# EAGLE design pwm-generator (EAGLE 6.5.0)
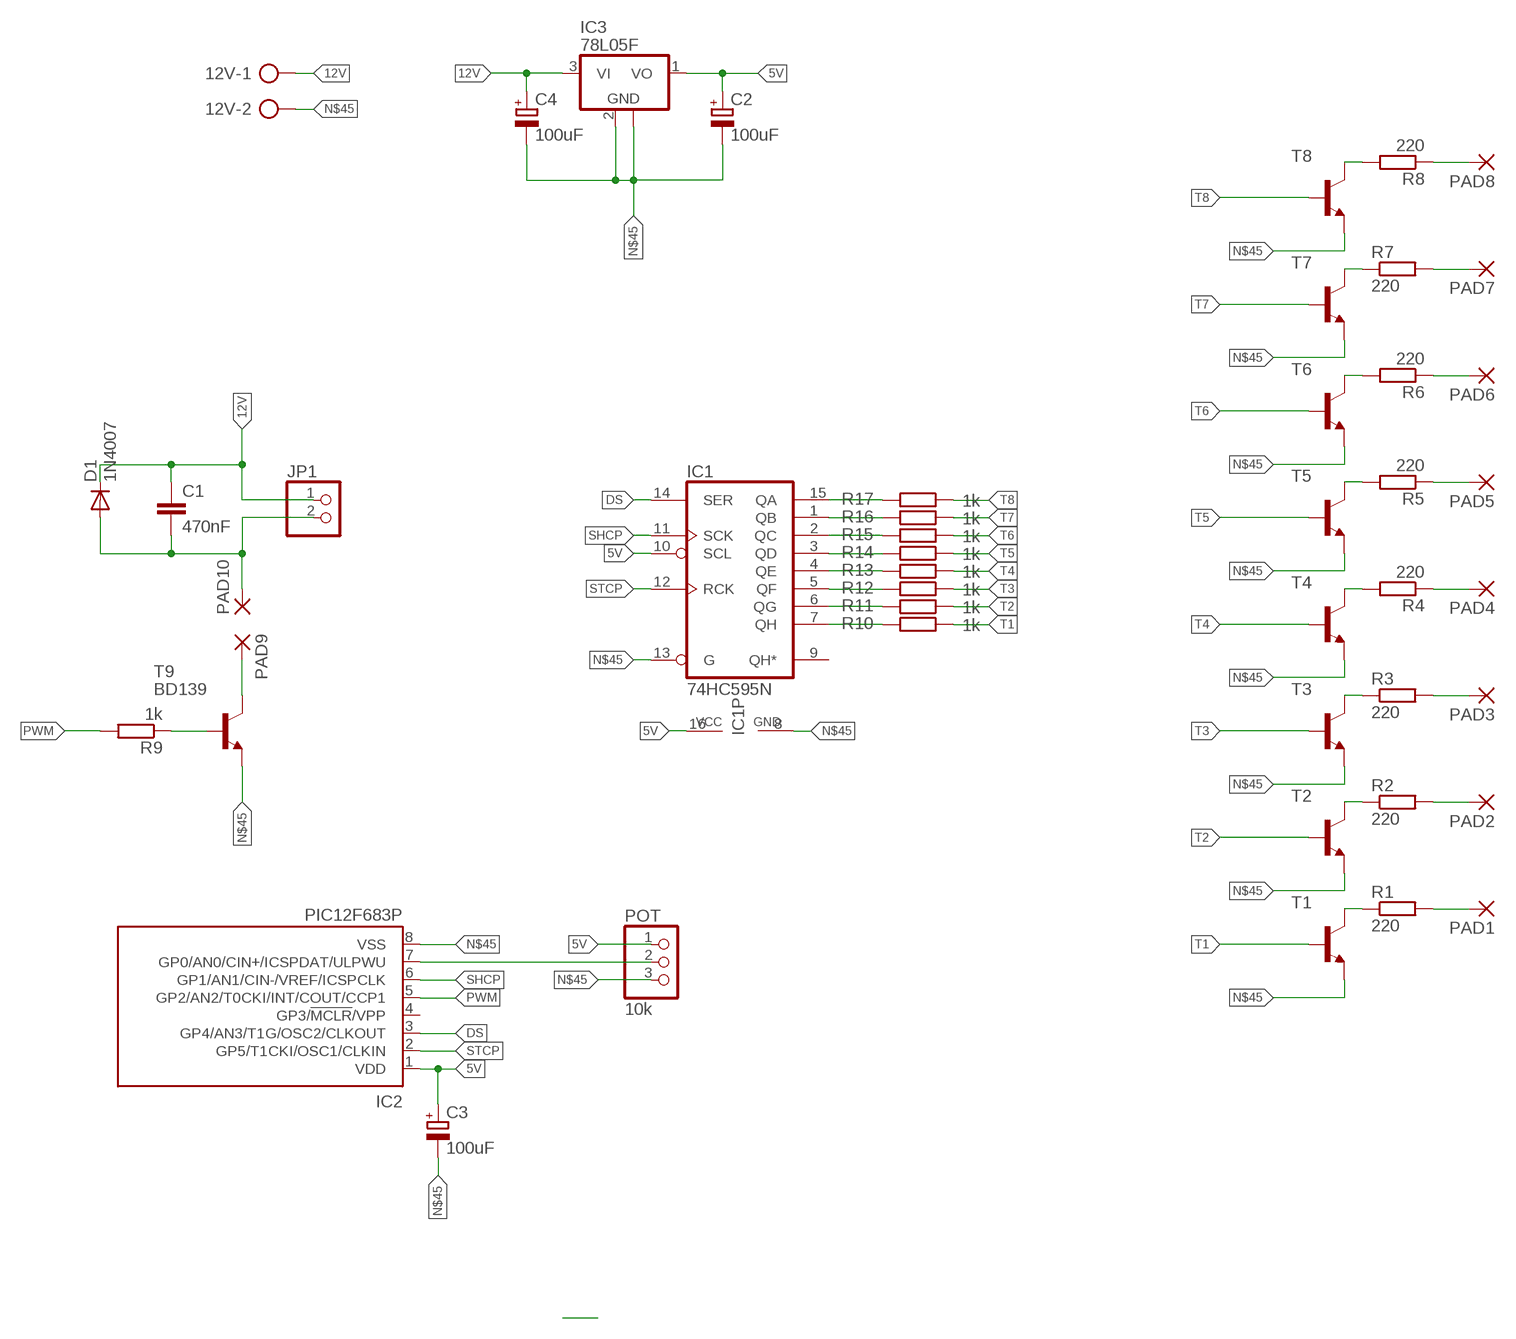
[diagram p0: schematic, sheet 1]

## Parts
12V  AK500/2  [AK500/2]
C1  470nF  C-EU025-025X050  [C025-025X050]
C2  100uF  CPOL-EUE2-5  [E2-5]
C3  100uF  CPOL-EUE5-4  [E5-4]
C4  100uF  CPOL-EUE2-5  [E2-5]
D1  1N4007  1N4148DO35-7  [DO35-7]
IC1  74HC595N  [DIL16]
IC2  PIC12F683P  [DIL8]
IC3  78L05F  [SOT89]
JP1  PINHD-1X2  [1X02]
PAD1  SMD2  [SMD1,27-2,54]
PAD2  SMD2  [SMD1,27-2,54]
PAD3  SMD2  [SMD1,27-2,54]
PAD4  SMD2  [SMD1,27-2,54]
PAD5  SMD2  [SMD1,27-2,54]
PAD6  SMD2  [SMD1,27-2,54]
PAD7  SMD2  [SMD1,27-2,54]
PAD8  SMD2  [SMD1,27-2,54]
PAD9  1,6/0,8  [1,6/0,8]
PAD10  1,6/0,8  [1,6/0,8]
POT  10k  PINHD-1X3  [1X03]
R1  220  R-EU_M0805  [M0805]
R2  220  R-EU_M0805  [M0805]
R3  220  R-EU_M0805  [M0805]
R4  220  R-EU_M0805  [M0805]
R5  220  R-EU_M0805  [M0805]
R6  220  R-EU_M0805  [M0805]
R7  220  R-EU_M0805  [M0805]
R8  220  R-EU_M0805  [M0805]
R9  1k  R-EU_M0805  [M0805]
R10  1k  R-EU_M0805  [M0805]
R11  1k  R-EU_M0805  [M0805]
R12  1k  R-EU_M0805  [M0805]
R13  1k  R-EU_M0805  [M0805]
R14  1k  R-EU_M0805  [M0805]
R15  1k  R-EU_M0805  [M0805]
R16  1k  R-EU_M0805  [M0805]
R17  1k  R-EU_M0805  [M0805]
T1  -NPN-SOT23-EBC  [SOT23-EBC]
T2  -NPN-SOT23-EBC  [SOT23-EBC]
T3  -NPN-SOT23-EBC  [SOT23-EBC]
T4  -NPN-SOT23-EBC  [SOT23-EBC]
T5  -NPN-SOT23-EBC  [SOT23-EBC]
T6  -NPN-SOT23-EBC  [SOT23-EBC]
T7  -NPN-SOT23-EBC  [SOT23-EBC]
T8  -NPN-SOT23-EBC  [SOT23-EBC]
T9  BD139  [TO126]

## Nets
5V: C2.+ C3.+ IC1.10(SCL) IC1.16(VCC) IC2.1(VDD) IC3.1(VO) POT.1
12V: 12V.1 C1.1 C4.+ D1.C IC3.3(VI) JP1.1
DS: IC1.14(SER) IC2.3(GP4/AN3/T1G/OSC2/CLKOUT)
N$1: IC1.7(QH) R10.2
N$2: IC1.6(QG) R11.2
N$3: IC1.5(QF) R12.2
N$4: IC1.4(QE) R13.2
N$5: IC1.3(QD) R14.2
N$6: IC1.2(QC) R15.2
N$7: IC1.1(QB) R16.2
N$8: IC1.15(QA) R17.2
N$9: IC2.7(GP0/AN0/CIN+/ICSPDAT/ULPWU) POT.2
N$10: C1.2 D1.A JP1.2 PAD10.1(P)
N$11: R9.1 T9.3(B)
N$12: R1.1 T1.C
N$13: R2.1 T2.C
N$14: R3.1 T3.C
N$15: R4.2 T4.C
N$16: R5.2 T5.C
N$17: R6.2 T6.C
N$18: R7.1 T7.C
N$19: R8.2 T8.C
N$20: PAD8.1(P) R8.1
N$21: PAD7.1(P) R7.2
N$22: PAD6.1(P) R6.1
N$23: PAD5.1(P) R5.1
N$24: PAD4.1(P) R4.1
N$25: PAD3.1(P) R3.2
N$26: PAD2.1(P) R2.2
N$27: PAD1.1(P) R1.2
N$28: PAD9.1(P) T9.2(C)
N$45: 12V.2 C2.- C3.- C4.- IC1.8(GND) IC1.13(G) IC2.8(VSS) IC3.2(GND) IC3.2@1(GND) POT.3 T1.E T2.E T3.E T4.E T5.E T6.E T7.E T8.E T9.1(E)
PWM: IC2.5(GP2/AN2/T0CKI/INT/COUT/CCP1) R9.2
SHCP: IC1.11(SCK) IC2.6(GP1/AN1/CIN-/VREF/ICSPCLK)
STCP: IC1.12(RCK) IC2.2(GP5/T1CKI/OSC1/CLKIN)
T1: R10.1 T1.B
T2: R11.1 T2.B
T3: R12.1 T3.B
T4: R13.1 T4.B
T5: R14.1 T5.B
T6: R15.1 T6.B
T7: R16.1 T7.B
T8: R17.1 T8.B
Unconnected: IC1.9(QH*) IC2.4(GP3/!MCLR!/VPP)

## Library data of the parts
12V = con-ptr500:AK500/2: CONNECTOR; OC_FARNELL: unknown; OC_NEWARK: unknown
C1 = resistor:C-EU: CAPACITOR, European symbol
C2-C4 = resistor:CPOL-EU: POLARIZED CAPACITOR, European symbol
D1 = diode:1N4148: DIODE high speed (Philips)
IC1 = 74xx-eu:74*595: 8-bit SHIFT REGISTER, output latch
IC2 = microchip:PIC12F683: 8-Pin Flash-Based, 8-Bit CMOS Microcontrollers with nanoWatt Technology Source: http://ww1.microchip.com/downloads/en/DeviceDoc/41211D_.pdf; MF: MICROCHIP; MPN: PIC12F683-I/P; OC_FARNELL: 9759034; OC_NEWARK: 89H0442
IC3 = linear:78L*: POSITOIV-VOLTAGE REGULATORS Output up to 100 mA Source: http://focus.ti.com/lit/ds/symlink/ua78l05.pdf
JP1 = pinhead:PINHD-1X2: PIN HEADER
PAD1-PAD8 = wirepad:SMD2: SMD PAD
PAD9 PAD10 = wirepad:1,6/0,8: THROUGH-HOLE PAD
POT = pinhead:PINHD-1X3: PIN HEADER
R1-R17 = resistor:R-EU_: RESISTOR, European symbol
T1-T8 = transistor:*-NPN-: NPN Transistror BF959 corrected 2008.03.06
T9 = transistor:BD139: NPN TRANSISTOR

## Board
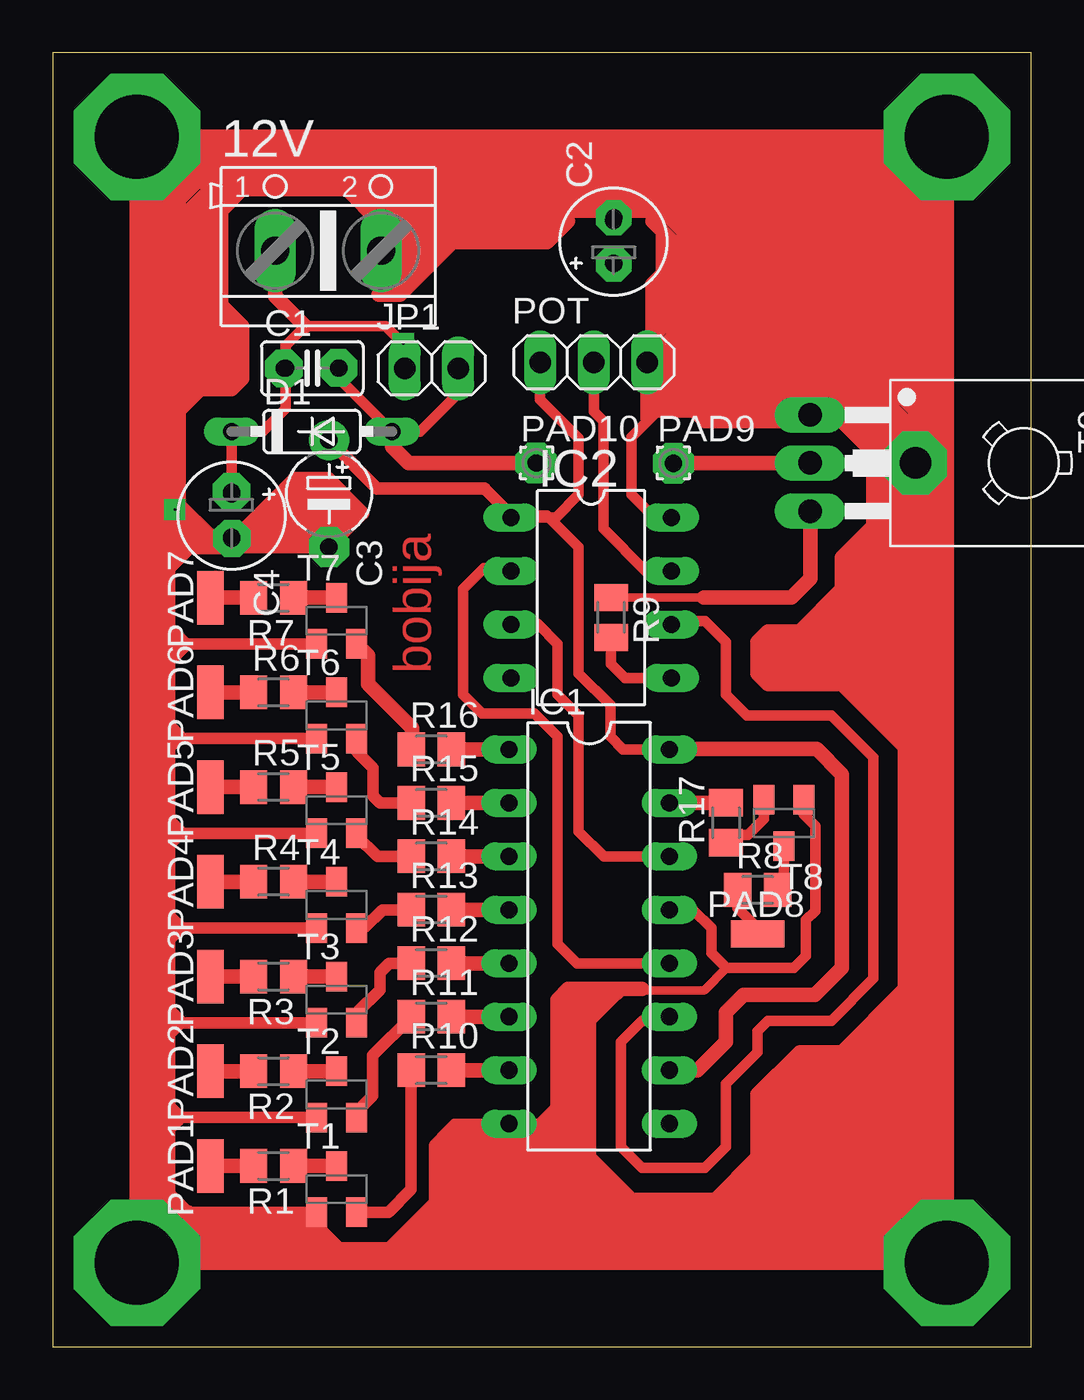
[diagram p1: board, top side]
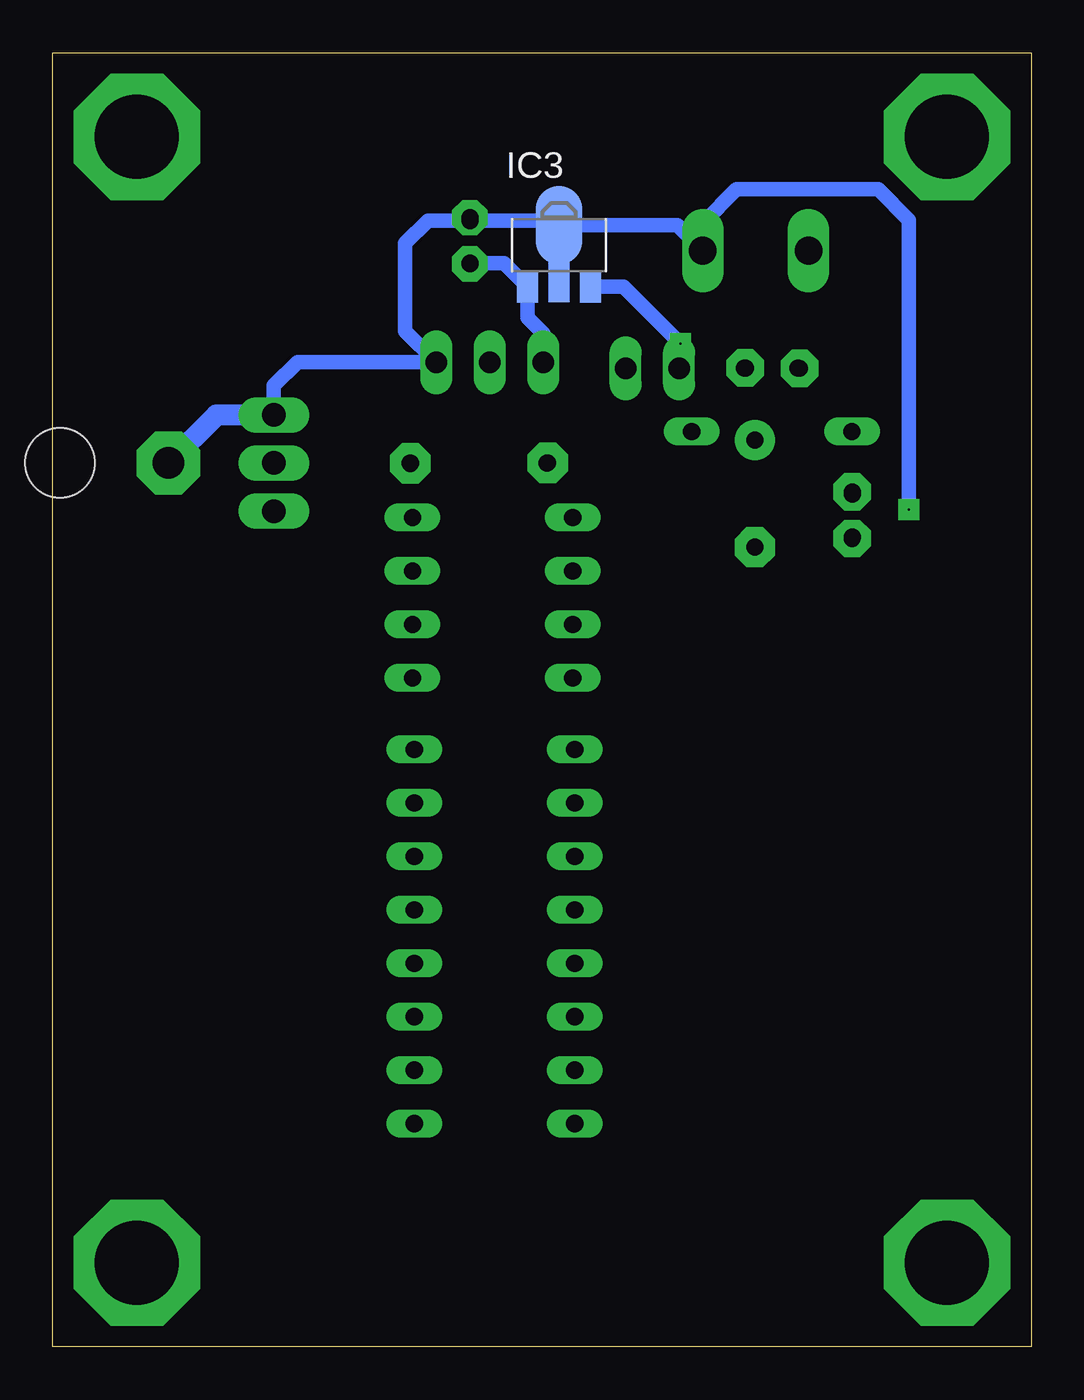
[diagram p2: board, bottom side, seen from below]

Size 46.5 x 61.5 mm. Coordinates in mm from the lower left corner, seen from the top.
Outline: 0,0 46.5,0 46.5,61.5 0,61.5 0,0
Copper layers (1*16): Top 0.035mm / dielectric 1.5mm / Bottom 0.035mm
Design rules "default": minimum track width 10mil, minimum drill 24mil, track to track 8mil, track to pad 8mil, pad to pad 8mil, via to via 8mil, smd to smd 8mil, copper to edge 40mil, drill to drill 8mil, minimum pad ring 10mil, minimum via ring 8mil, stop-mask expansion 4mil, vias tented up to drill 0mil, thermal gap 10mil

### Footprints (pad centres in the part's own frame; a part is rotated, then mirrored left to right if it is on the bottom)
AK500/2 = drill 1.321 long: 1 -2.515,0; 2 2.515,0
C025-025X050 = drill 0.813 octagon: 1 -1.27,0; 2 1.27,0
E2-5 = drill 0.813 pad 1.27: + -1.016,0 | drill 0.813 pad 1.27 octagon: - 1.016,0
E5-4 = drill 0.813 pad 1.905: + -2.54,0 | drill 0.813 pad 1.905 octagon: - 2.54,0
DO35-7 = drill 0.813 long: A 3.81,0; C -3.81,0
DIL16 = drill 0.813 long: 1 -8.89,-3.81; 2 -6.35,-3.81; 3 -3.81,-3.81; 4 -1.27,-3.81; 5 1.27,-3.81; 6 3.81,-3.81; 7 6.35,-3.81; 8 8.89,-3.81; 9 8.89,3.81; 10 6.35,3.81; 11 3.81,3.81; 12 1.27,3.81; 13 -1.27,3.81; 14 -3.81,3.81; 15 -6.35,3.81; 16 -8.89,3.81
DIL8 = drill 0.813 long: 1 -3.81,-3.81; 2 -1.27,-3.81; 3 1.27,-3.81; 4 3.81,-3.81; 5 3.81,3.81; 6 1.27,3.81; 7 -1.27,3.81; 8 -3.81,3.81
SOT89 = smd 1 x 1.5: 1 -1.499,-1.981; 3 1.499,-1.981 | smd 1 x 2: 2 0,-1.727 | smd 2.2 x 3.7: 2@1 0,0.94
1X02 = drill 1.016 long: 1 -1.27,0; 2 1.27,0
SMD1,27-2,54 = smd 1.27 x 2.54: 1 0,0
1,6/0,8 = drill 0.813 pad 1.6 octagon: 1 0,0
1X03 = drill 1.016 long: 1 -2.54,0; 2 0,0; 3 2.54,0
M0805 = smd 1.3 x 1.6: 1 -0.95,0; 2 0.95,0
SOT23-EBC = smd 1 x 1.4: B 0.95,-1.1; C 0,1.1; E -0.95,-1.1
TO126 = drill 1.118 long: 1 -2.286,-5.08; 2 0,-5.08; 3 2.286,-5.08 | hole 3.302: 0,5.08

### Placement (x,y rotation side)
12V  13.09,52.09 0 top
C1  12.34,46.5 0 top
C2  26.66,52.51 90 top
C3  13.13,40.54 270 top
C4  8.5,39.5 270 top
D1  12.32,43.5 0 top
IC1  25.5,19.5 270 top
IC2  25.59,35.6 270 top
IC3  22.43,52.36 0 bottom
JP1  18,46.5 0 top
PAD1  7.5,8.6 0 top
PAD2  7.5,13.1 0 top
PAD3  7.5,17.6 0 top
PAD4  7.5,22.1 0 top
PAD5  7.5,26.6 0 top
PAD6  7.5,31.1 0 top
PAD7  7.5,35.6 0 top
PAD8  33.5,19.62 270 top
PAD9  29.5,42 0 top
PAD10  23,42 0 top
POT  25.72,46.79 0 top
R1  10.5,8.6 180 top
R2  10.5,13.1 180 top
R3  10.5,17.6 180 top
R4  10.5,22.1 0 top
R5  10.5,26.6 0 top
R6  10.5,31.1 0 top
R7  10.5,35.6 180 top
R8  33.5,21.71 0 top
R9  26.54,34.66 270 top
R10  18,13.15 0 top
R11  18,15.69 0 top
R12  18,18.23 0 top
R13  18,20.77 0 top
R14  18,23.31 0 top
R15  18,25.85 0 top
R16  18,28.39 0 top
R17  32,24.9 90 top
T1  13.5,7.5 0 top
T2  13.5,12 0 top
T3  13.5,16.5 0 top
T4  13.5,21 0 top
T5  13.5,25.5 0 top
T6  13.5,30 0 top
T7  13.5,34.5 0 top
T8  34.75,24.9 180 top
T9  41.07,42 270 top

### Tracks (layer width: path | path; a pad name or v marks a point on that pad's centre or on a via)
5V
  Top 0.5: IC1.16 27.11,28.39 26.5,29 26.5,30.5 25,32 25,38 23.5,39.5 21.87,39.5 IC2.1 23.91,39.41 25,40.5 25,43.19 23.17,45.02 POT.1
  Top 0.6: IC2.1 21.78,39.53 20.53,40.78 15.43,40.78 C3.+
  Top 0.7: IC1.10 30.65,13.15 32,14.5 32,15.9 32.82,16.72 36.22,16.72 37.5,18 37.5,27.21 36.31,28.4 IC1.16
  Bottom 0.7: C2.+ 25.04,51.49 IC3.1 23.93,48.9 23.17,48.14 POT.1
12V  (via drill 0.1 pad 1, 0.8 pad 1.78)
  Top 0.5: C4.+ v8.5,40.62 D1.C 9.99,43.5 11.07,44.58 C1.1 11.07,47.57 12,48.5 15.83,48.5 v16.66,47.66 16.73,47.6 JP1.1
  Top 0.7: 12V.1 10.57,49.92 12,48.5
  Bottom 0.7: IC3.3 19.38,50.38 v16.66,47.66
DS
  Top 0.5: IC1.14 26.19,23.31 25,24.5 25,30 24,31 24,33.4 23.06,34.34 IC2.3
N$1
  Top 0.7: IC1.7 R10.2
N$2
  Top 0.7: R11.2 IC1.6
N$3
  Top 0.7: IC1.5 R12.2
N$4
  Top 0.7: R13.2 IC1.4
N$5
  Top 0.7: R14.2 IC1.3
N$6
  Top 0.7: R15.2 IC1.2
N$7
  Top 0.7: R16.2 IC1.1
N$8
  Top 0.7: R17.2 IC1.15
N$9
  Top 0.5: IC2.7 28.18,36.87 26.17,38.88 26.17,44 25.73,44.44 POT.2
N$10
  Top 0.5: C1.2 13.61,46.02 D1.A 17.47,43.5 19.26,45.29 JP1.2
  Top 0.7: PAD10.1 16.92,42 16.14,42.78 D1.A
N$11
  Top 0.4: R9.1 30.96,35.61
  Top 0.7: 30.96,35.61 35.11,35.61 36,36.5 T9.3
N$12
  Top 0.7: R1.1 T1.C
N$13
  Top 0.7: R2.1 T2.C
N$14
  Top 0.7: R3.1 T3.C
N$15
  Top 0.7: R4.2 T4.C
N$16
  Top 0.7: R5.2 T5.C
N$17
  Top 0.7: R6.2 T6.C
N$18
  Top 0.7: R7.1 T7.C
N$19
  Top 0.5: T8.C 34.75,22.01 R8.2
N$20
  Top 0.5: PAD8.1 33.5,19.91 32.55,20.86 R8.1
N$21
  Top 0.7: R7.2 PAD7.1
N$22
  Top 0.7: R6.1 PAD6.1
N$23
  Top 0.7: R5.1 PAD5.1
N$24
  Top 0.7: R4.1 PAD4.1
N$25
  Top 0.7: PAD3.1 R3.2
N$26
  Top 0.7: PAD2.1 R2.2
N$27
  Top 0.7: PAD1.1 R1.2
N$28
  Top 0.7: PAD9.1 T9.2
N$29
  Top 0.7: 42,41.5 42,42.5 | 42,42.5 41.5,42.5 41.5,42 42,42.5
N$30
  Top 0.7: 5.79,19.94 5.97,19.94 5.97,19.85 5.52,19.4
N$33  (via drill 0.8 pad 1.78)
  other vias: 11,46.5
N$34  (via drill 0.8 pad 1.78)
  other vias: 13.58,46.51
N$35  (via drill 0.8 pad 1.78)
  other vias: 8.51,38.41
N$36  (via drill 0.8 pad 1.93)
  other vias: 22.97,42.01
N$37  (via drill 0.8 pad 1.93)
  other vias: 29.5,41.98
N$38  (via drill 0.8 pad 1.68)
  other vias: 26.67,53.66
N$39  (via drill 0.8 pad 1.68)
  other vias: 26.67,51.46
N$40
  Top 0.6: 13,38 8.97,38 | 8.13,38 8.97,38 | 8.97,38 8.97,38.76 11.48,41.28 13.11,41.28 14.76,39.63 14.76,39.59 13.12,37.95 13.12,38.43 14.14,39.45 14.14,39.86 13.14,40.86 11.51,40.86 9.47,38.82 12.96,38.82 13.75,39.61 13.75,39.77 13.06,40.46 11.56,40.46 10.28,39.18 12.65,39.18 13.15,39.68 13.15,39.69 12.84,40 11.48,40 11.02,39.54 12.55,39.54 12.64,39.63
N$41
  Top 0.7: 38,31.5 42,31.5 42,31 38.5,31 39,30.5 42,30.5 42,30 39.5,30 40,29.5 42,29.5 42,29 40.5,29 41,28.5 42,28.5
N$42
  Top 0.7: 23.5,53.5 17,53.5 16.5,53
N$43
  Top 0.6: 12.83,4.68 12.83,4.88 12.74,4.97 12.74,5.83 12.73,5.84 12.73,5.83 12.75,5.81 12.75,5.68 | 12.75,5.68 12.75,4.95 | 12.75,4.95 12.7,4.9 12.7,4.88 12.78,4.8 | 12.23,6 12.43,6 12.75,5.68 | 12.75,4.95 12.75,4.87 12.77,4.85
N$44
  Top 0.6: 11.44,5.4 11.44,5.51 11.17,5.78 12.55,5.78 13.98,4.35
N$45  (via drill 0.1 pad 1, 1.5 pad 3, 4 pad 6)
  Top 0.4: 27.87,16.94 30.97,16.94 32.03,18
  Top 0.5: 6.48,38.48 5.5,37.5 5.5,37 5.5,34.3 6.4,33.4 | T8.E 35.7,25.3 36.24,24.76 36.24,20.72 35.8,20.28 35.8,18.57 35.23,18 32.03,18 31.31,18.72 31.31,19.9 30.44,20.77 IC1.13 | 27.87,16.94 27.86,16.95 26.45,16.95 25,15.5 25,12.5 23.11,10.61 IC1.8 19.11,10.61 18.5,10 18.5,6.5 16.73,4.73 13.27,4.73 12.5,5.5 12.5,6.35 T1.E | IC2.8 28.59,39.41 27.5,40.5 27.5,43.23 28.26,43.99 POT.3
  Top 0.55: T7.E 6.4,33.4 5.5,32.5 5.5,29 | 5.5,29 5.5,28.5 5.5,24.5 | 5.5,24.5 5.5,20 | 5.5,20 5.5,16 5.5,15.5 | 5.5,15.5 5.5,15 5.5,11 | 5.5,11 5.5,7.35 6.45,6.4 T1.E | T6.E 5.6,28.9 5.5,29 | T5.E 5.6,24.4 5.5,24.5 | T4.E 5.6,19.9 5.5,20 | T3.E 5.6,15.4 5.5,15.5 | T2.E 5.6,10.9 5.5,11
  Top 0.6: C4.- 12.65,38.48 C3.- | 27.5,5.5 28.85,5.5 28.91,5.44
  Top 0.7: 28.5,46.5 33.5,46.5 36,44 | 35.5,44 31,44 30.5,44.5 28.63,44.5 28.27,44.14 28.27,46.77 28.5,47 | 28.5,48 28.5,50.5 29,51 29,53 | 29,53 28.5,53.5 | 29,53 29.5,52.5 29.5,48 28.5,47 | 28.5,47 28.5,48 | 28.5,48 29,48.5 29,50.5 | 28.5,47 29.5,47 | 32.5,47 34.5,47 | 34.5,47 36,45.5 36,45 | 36,45 36,44.5 36.5,44 | 36.5,44 36,44 | 35.5,44 35.5,45 | 34,46.5 34,45.5 | 34,45.5 35,44.5 31,44.5 30.5,45 28.5,45 28.5,46 33,46 33.5,45.5 | 33.5,45.5 34,45 29.5,45 29,45.5 33.5,45.5 | 36,45 35.5,45 | 35.5,45 34,46.5 | 34,46.5 34.5,46.5 35.5,45.5 39.5,45.5 40,45 | 35.5,44 36,44 | 41,41 41,40 40,39 | 40,39 38.5,37.5 41.5,37.5 41.5,40 | 41.5,40.5 41.5,40 | 41.5,40 39.5,38 41,38 41,39 40.5,38.5 | 6,45 6,46 | 6,46 6,53.5 7.5,55 8,55 | 9,55 8,54 8,49.5 9,48.5 9,46 8.5,45.5 7,45.5 | 6,44.5 6,45 | 6,45 7,46 7,45.5 | 7,45.5 6,44.5 | 6,44.5 6,40 7.5,38.5 7,38.5 6.5,38 | 41,28 41,17 37.5,13.5 35.5,13.5 34,12 34,9 31.5,6.5 28,6.5 | v5.81,39.78 6.48,39.11 6.48,38.48 C4.- | v4,4 4.05,4 6.45,6.4 | v42.5,4 42.5,40.5 | 42.5,40.5 v41,42 | 42.5,53 v42.5,57.5 6,57.5 | 42.5,53 42.5,43.5 | 42.5,43.5 v41,42 | 5,57.5 v4,57.5 v4,4 | 5,57.5 6,57.5 | v4,4 v42.5,4 | 42.5,43.5 42.5,40.5 | 4.5,4.5 4.5,21 | 4.5,21 4.5,30 | 4.5,30 4.5,38 | 4.5,38 4.5,57 5,57.5 | 5,57.5 5,25.5 | 5,25.5 5,24.5 | 5,24.5 5,23.5 | 5,23.5 5,15.5 | 5,15.5 5,11.5 | 5,11.5 5,7 | 5,7 5,4.5 5.5,4.5 | 5.5,4.5 5.5,15 | 5.5,15 5.5,16 | 5.5,16 5.5,28.5 | 5.5,28.5 5.5,33 | 5.5,33 5.5,37 | 5.5,37 5.5,39.5 | 5.5,39.5 5.5,54 | 5.5,54 5.5,57 6,57.5 | 6,57.5 6,56.5 | 6,54 6,56.5 | 6,56.5 6.5,57 42,57 42,43.5 41,42.5 39.5,44 | 39.5,44 39,44.5 | 39,44.5 38,44.5 | 38,44.5 37,44.5 36.5,45 36.5,45.5 35,47 34.5,47 | 32.5,47 29.5,47 | 29.5,47 29.5,47.5 30,48 30,53 29,54 17,54 16.5,53.5
  Top 0.7: 16.5,53.5 16,53 16,53.5 14.5,55 15.5,55 16.5,54 16.5,54.5 15.5,55.5 | 15.5,55.5 15,55.5 | 15,55.5 7,55.5 | 7,55.5 6.5,55 | 6.5,55 6.5,55.5 7,55.5 | 15.5,55.5 16,55.5 17,54.5 29,54.5 30.5,53 30.5,48 30,47.5 35,47.5 37.5,45 39.5,45 41,43.5 41.5,43.5 41.5,56.5 6.5,56.5 6.5,56 41,56 41,44.5 | 41,44.5 40,45.5 38,45.5 35.5,48 35,48 | 35,48 31,48 31,53 | 31,53 31,53.5 29.5,55 17,55 16.5,55.5 39,55.5 | 39,55.5 40.5,55.5 40.5,53 | 40.5,53 40.5,45.5 40,46 39,46 | 39,46 38,46 35.5,48.5 31.5,48.5 31.5,53.5 30,55 39.5,55 40,54.5 | 40,54.5 40,55 | 40,54.5 40,46.5 38,46.5 35.5,49 32,49 32,53.5 31,54.5 39,54.5 39.5,54 39.5,47 38,47 35.5,49.5 32.5,49.5 32.5,53.5 32,54 39,54 39,47.5 38.5,47.5 38.5,53.5 33,53.5 33,50 35.5,50 38,47.5 38,53 33.5,53 33.5,50.5 35.5,50.5 37.5,48.5 37.5,52.5 35.5,52.5 | 35.5,52.5 34,52.5 34,51 35.5,51 37,49.5 37,52 34.5,52 34.5,51.5 35.5,51.5 36.5,50.5 36.5,51.5 | 35.5,52.5 35.5,52 36,51.5 | 35,48 37.5,45.5 | 31,53 29.5,54.5 | 5.5,54 6.5,55 | 4.5,38 5.5,38 6,38.5 6,39 5.5,39.5 | 5.5,33 6,33.5 | 4.5,30 5,30 6,29 5.5,28.5 | 5,25.5 6,24.5 | 6,24.5 5,23.5 | 5,24.5 6,24.5 | 6,24.5 6,24.39 5.2,23.59 | 4.5,21 4.96,21 5.97,19.99 | 5.5,16 6,15.5 5.5,15 | 5,15.5 5.93,15.5 5.97,15.46 5.97,15.37 5.63,15.03 | 5,11.5 5.4,11.5 5.91,10.99 5.91,10.8 5.62,10.51 | 5,7 5.5,7 6,6.5 | 5.5,4.5 13,4.5 | 17,4.5 13,4.5 | 13,4.5 12,5.5 12,6 7,6 6,5 12,5 11.5,5.5 7,5.5 | v42.5,4 30.5,4 28,6.5 | 27.5,7 25.5,9 | 25.5,9 25,9.5 | 25,9.5 25,12 | 25,12 25,15.5 24.5,15 24.5,11.5 | 25,12 24.5,11.5 | 24.5,11.5 23.5,10.5 | 23.5,10.5 23,10 19,10 19,6.5 17,4.5 | 17,4.5 29,4.5 | 29.5,4.5 29,4.5 | 29,4.5 28,5.5 | 25,8.5 24.5,9 | 24.5,9 24.5,10.5
  Top 0.7: 24.5,10.5 23.5,9.5 19.5,9.5 19.5,6.5 18,5 28,5 | 28,5 28,5.5 | 28,5.5 26.5,7 | 24.5,9 24,9.5 | 24,9.5 24,9 27.5,5.5 19.5,5.5 | 19,5.5 19.5,5.5 | 19.5,5.5 20,6 | 20,6 20,9 23.5,9 26.5,6 20,6 | 19.5,6 20,6 | 20,6 20.5,6.5 | 20.5,7.5 20.5,8.5 23.5,8.5 25.5,6.5 20.5,6.5 | 20.5,6.5 20.5,7.5 | 20.5,7.5 21,8 23.5,8 24.5,7 21,7 21,7.5 23.5,7.5 | 23.5,10.5 28,6 31.5,6 34.5,9 34.5,12 35,12.5 | 23.5,10.5 19.15,10.5 18.21,9.56 18.21,6.84 16.04,4.67 | 39,46 39,45 40,44 | 40,44 41,43 41,44.5 | v41,42 40,41 40,40 37.5,37.5 37.5,36 35.5,34 34,34 33.5,33.5 33.5,32 34,31.5 37.5,31.5 40.5,28.5 40.5,17 37.5,14 35.5,14 33.5,12 33.5,9 31.5,7 27.5,7 | 27.5,7 26.5,7 | 26.5,7 25,8.5 | 24,9.5 23.5,10 | 28,6.5 27.5,7 | 25.5,9 25.5,15.6 26.75,16.85 26.79,16.85 26.81,16.83 26.78,16.83 25.56,15.61 | 25,8.5 25,9.5 | 24,9.5 24,13 | 24,13 24,14.57 | 24,14.57 26.31,16.88 26.84,16.88 26.86,16.9 | 35,12.5 35.5,13 37.5,13 41.5,17 41.5,28 42,28 42,5 41.5,4.5 | 41.5,4.5 30.5,4.5 29.5,5.5 41,5.5 41.5,5 | 41.5,5 42,4.5 41.5,4.5 | 41.5,4.5 41,5 28,5 | 41.5,5 41.5,16.5 37.5,12.5 35,12.5 | 35,12.5 35,9 32,6 41,6 41,15.5 37.5,12 35.5,12 35.5,9 33,6.5 40.5,6.5 40.5,14.5 37.5,11.5 36,11.5 36,9 34,7 40,7 40,13.5 39.5,13.5 | 39.5,13.5 39,13.5 36.5,11 36.5,10.5 | 36.5,10.5 36.5,10 | 36.5,10 36.5,9 35,7.5 39.5,7.5 39.5,13 37,10.5 | 37,10.5 37,10 | 37,10 37,9 | 37,9 36,8 39,8 39,12 37,10 | 37,9 37,8.5 38.5,8.5 38.5,11 37.5,10 37.5,9 38,9 38,10 | 36.5,10 37,10 | 39.5,13.5 36.5,10.5 | 36.5,10.5 37,10.5 | 5.5,37 6.5,38 | 6.5,38 8,38 | 9,55 8,55 | 8,55 7.5,54.5 | 7.5,54.5 6.5,53.5 6.5,46.5 6,46 | 6,46 8.5,46 8.5,48.5 7.5,49.5 7.5,54 | 7.5,54.5 7.5,54 | 7.5,54 7,53.5 7,46.5 8,46.5 8,48.5 7.5,49 7.5,47
  Top 0.7: 7.5,54 8,54.5 7,55.5 | 40.5,53 42.5,53 | 39,55.5 39,55 39.5,54.5 | 15,55.5 15,55 16.5,53.5 | 9,55 14,55 15.5,53.5 15.5,51.5 | 19,52.5 23.5,52.5 24.5,53.5 24,53.5 23.5,53 17.5,53 | 19,52.5 18.5,52.5 | 18.5,52.5 18,52.5 16,50.5 | 16,51 16,51.5 | 16,51.5 15.5,52 16,52 17,53 17.5,53 | 17.5,53 16,51.5 | 16,51.5 15.5,51.5 | 15.5,51.5 15.5,51 16,50.5 | 16.5,50 16.5,50.5 18.5,52.5 | 15.5,51.5 16,51 | 16,51 17.5,52.5 | 40,39 40,44 | 40,44 39.5,44 | 41,41.5 40.5,41 40.5,40 39.5,39 | 39,38.5 38,37.5 38,36 35.5,33.5 | 35.5,33.5 34,33.5 34,32 42,32 42,40.5 40.5,42 | 41.5,32.5 34.5,32.5 34.5,33 41.5,33 41.5,33.5 36.5,33.5 | 36,33.5 36.5,33.5 | 36.5,33.5 37,34 41.5,34 41.5,37 38.5,37 38.5,36 37,34.5 | 37,34.5 41,34.5 41,35 | 41,35.5 41,36.5 39,36.5 39,36 38,35 41,35 | 41,35 41,35.5 | 41,35.5 40.5,36 39.5,36 39,35.5 40.5,35.5 | 35.5,33.5 36,33.5 | 36,33.5 37,34.5 | 39.5,44 39.5,39 | 39.5,39 39,38.5 | 39,38.5 39,42.5 | 39,43.5 39,44.5 | 36.5,44 37.5,44 39,42.5 | 39,42.5 39,43 | 39,43 39,43.5 | 39,43.5 38,44.5 | 38,44.5 38,44 39,43 | 34,45.5 32.5,47 | 24.5,10.5 24.5,12.5 24,13 | 24,14.57 24,16.5 24.5,17 26,17 | 28,17 26,17 | 26,17 24.5,15.5 24.5,16.5 25,16.5 | 16,51 16,50.5 | 16,50.5 16.5,50 | 19,52.5 16.5,50 | 16.5,50 15.5,50
  Bottom 0.5: IC3.2@1 IC3.2
  Bottom 0.7: v5.81,39.78 v5.8,39.79 5.8,53.55 7.25,55 14,55 15.61,53.4 12V.2 16.82,53.3 IC3.2@1 22.66,53.53 C2.- 28.65,53.53 29.74,52.44 29.74,48.27 POT.3 34.86,46.8 35.99,45.67 T9.1
  Bottom 1: T9.1 38.71,44.29 v41,42
PWM
  Top 0.5: IC2.5 27.19,31.79 26.54,32.44 R9.2
SHCP
  Top 0.5: IC2.6 29.57,34.5 31,34.5 32,33.5 32,31 33,30 37,30 39,28 39,17.5 37,15.5 34,15.5 33.5,15 33.5,14 32,12.5 32,9.5 31,8.5 28,8.5 27,9.5 27,14.5 28,15.5 29.12,15.5 IC1.11
STCP
  Top 0.5: IC1.12 24.91,18.23 24,19.14 24,29 22.9,30.1 20.4,30.1 19.5,31 19.5,36 20.5,37 21.65,37 IC2.2
T1
  Top 0.55: T1.B 15.96,6.4 17.04,7.48 R10.1
T2
  Top 0.55: T2.B 14.45,11.16 15.21,11.92 15.21,13.85 R11.1
T3
  Top 0.55: T3.B 14.45,15.86 15.55,16.96 15.55,17.8 15.98,18.23 R12.1
T4
  Top 0.55: T4.B 14.81,19.9 15.68,20.77 R13.1
T5
  Top 0.55: T5.B 14.45,24.29 15.44,23.3 R14.1
T6
  Top 0.55: T6.B 14.45,28.29 15.22,27.52 15.22,26.18 15.55,25.85 R15.1
T7
  Top 0.55: 17.08,28.42 R16.1
  Top 0.7: 17.08,28.42 17.08,29.42 15,31.5 15,32.85 T7.B
T8
  Top 0.5: T8.B 33.8,25.09 33.03,24.32 32.37,24.32 R17.1

### Text on the board
Top: bobija